# Altium schematic sheet PGA.SCHDOC
size B
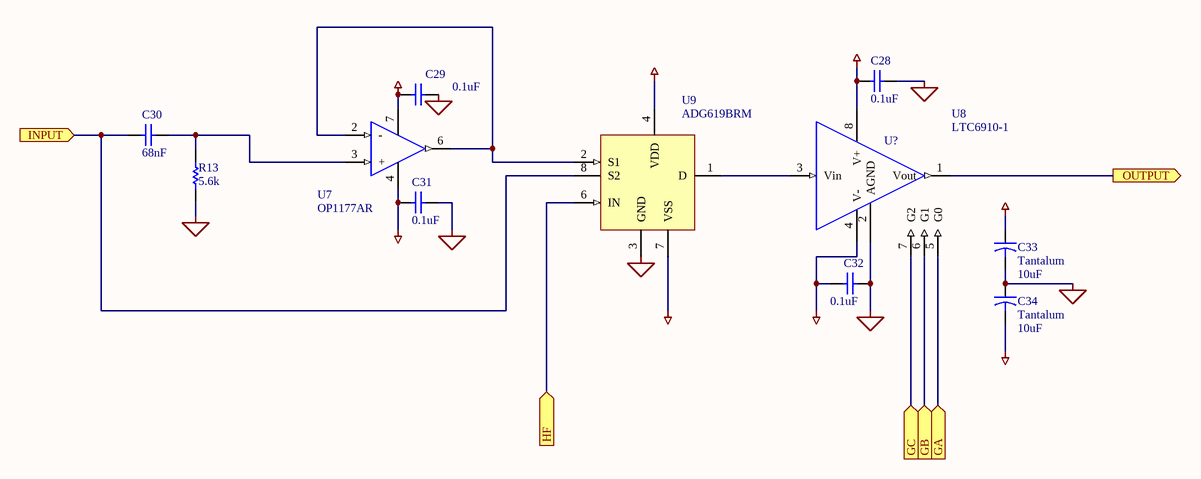
[diagram p0: PGA.SCHDOC]

## Parts
C28  value 0.1uF  [CC1608-0603]  (hidden comment: Cap)
C29  value 0.1uF  [CC1608-0603]  (hidden comment: Cap)
C30  value 68nF  [CC1608-0603]  (hidden comment: Cap)
C31  value 0.1uF  [CC1608-0603]  (hidden comment: Cap)
C32  value 0.1uF  [CC1608-0603]  (hidden comment: Cap)
C33  Tantalum  value 10uF  [TC3216-1206]
C34  Tantalum  value 10uF  [TC3216-1206]
R13  value 5.6k  [CC1608-0603]  (hidden comment: Res1)
U7  OP1177AR  [TSSO3X5-G8/X.4]
U8  LTC6910-1  [TSOT-23-8]
U9  ADG619BRM  [MSOP8]

## Ports
GA (in), GB (in), GC (in), HF (in), INPUT (in), OUTPUT (out)

## Nets
AGND: C28.2 C29.2 C31.2 C32.1 C33.2 C34.1 R13.1 U8.2(AGND) U9.3(GND)
AVDD: C28.1 C29.1 C33.1 U7.7(+Vs) U8.8(V+) U9.4(VDD)
AVSS: C31.1 C32.2 C34.2 U7.4(-Vs) U8.4(V-) U9.7(VSS)
GA: U8.5(G0) ; port GA
GB: U8.6(G1) ; port GB
GC: U8.7(G2) ; port GC
HF: U9.6(IN) ; port HF
INPUT: C30.2 U9.8(S2) ; port INPUT
OUTPUT: U8.1(Vout) ; port OUTPUT
NetC30_1: C30.1 R13.2 U7.3(+)
NetU7_2: U7.2(-) U7.6(Out) U9.2(S1)
NetU8_3: U8.3(Vin) U9.1(D)

## Notes on the sheet
- (in symbol LTC6910-1) U?

## Library data of the parts
C28-C32 = Cap: Capacitor; Manufacturer: Generic Components; Class I: Passive; Published: 8-Jun-2000; Revision: July-2002: Re-released for DXP Platform.; Publisher: Altium Limited; Class II: Capacitor
C33 C34 = Cap2: Capacitor; Manufacturer: Generic Components; Class I: Passive; Published: 23-Sep-2002; Publisher: Altium Limited; Class II: Capacitor
R13 = Res1: Resistor; Manufacturer: Generic Components; Class I: Passive; Published: 8-Jun-2000; Revision: July-2002: Re-released for DXP Platform.; Publisher: Altium Limited; Class II: Resistor
U7 = OP1177: Precision Low Noise, Low Input Bias Current Operational Amplifier; Vendor: Analog Devices
U8 = LTC6910-1: LTI Digitally Controlled Programmabe Gain Amp; Vendor: Linear Technology
U9 = ADG619: Low RON SPDT Switch (s2 normally on); Vendors: Analog Devices